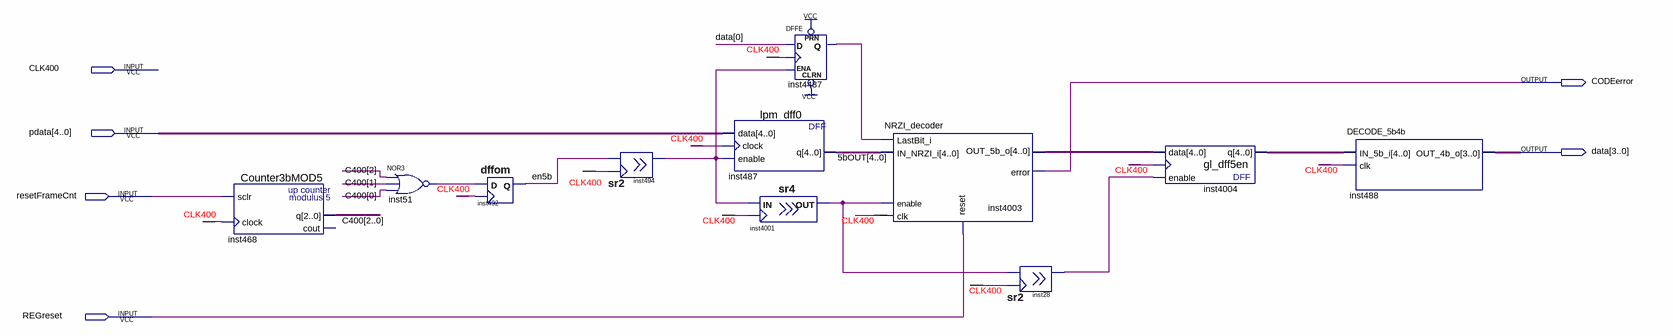
[diagram p0: schematic sheet]
// Quartus schematic NRZI_5B4B_decoder.bdf as structural Verilog: 11 symbols, 6 pins
module NRZI_5B4B_decoder (
  input  CLK400,
  input  [4:0] pdata,
  input  resetFrameCnt,
  input  REGreset,
  output CODEerror,
  output [3:0] data
);

  wire en5b, inst28_out, inst51_out, inst494_out, inst4001_out, inst4487_q;
  wire [2:0] C400;
  wire [4:0] \5bOUT , inst4003_out_5b_o, inst4004_q;

  Counter3bMOD5 inst468 (.sclr(resetFrameCnt), .clock(CLK400), .q(C400));  // open: cout
  nor inst51 (inst51_out, C400[2], C400[1], C400[0]);
  dffom inst492 (.D(inst51_out), .CK(CLK400), .Q(en5b));
  sr2 inst494 (.CLK(CLK400), .IN(en5b), .OUT(inst494_out));
  lpm_dff0 inst487 (.data(pdata), .clock(CLK400), .enable(inst494_out), .q(\5bOUT ));
  DFFE inst4487 (.PRN(1'b1), .CLRN(1'b1), .D(data[0]), .CLK(CLK400), .ENA(inst494_out), .Q(inst4487_q));
  sr4 inst4001 (.IN(inst494_out), .CLK(CLK400), .OUT(inst4001_out));
  NRZI_decoder inst4003 (
    .clk(CLK400), .reset(REGreset), .enable(inst4001_out), .IN_NRZI_i(\5bOUT ), .LastBit_i(inst4487_q),
    .OUT_5b_o(inst4003_out_5b_o), .error(CODEerror));
  sr2 inst28 (.CLK(CLK400), .IN(inst4001_out), .OUT(inst28_out));
  gl_dff5en inst4004 (.data(inst4003_out_5b_o), .enable(inst28_out), .clock(CLK400), .q(inst4004_q));
  DECODE_5b4b inst488 (.IN_5b_i(inst4004_q), .clk(CLK400), .OUT_4b_o(data));
endmodule
